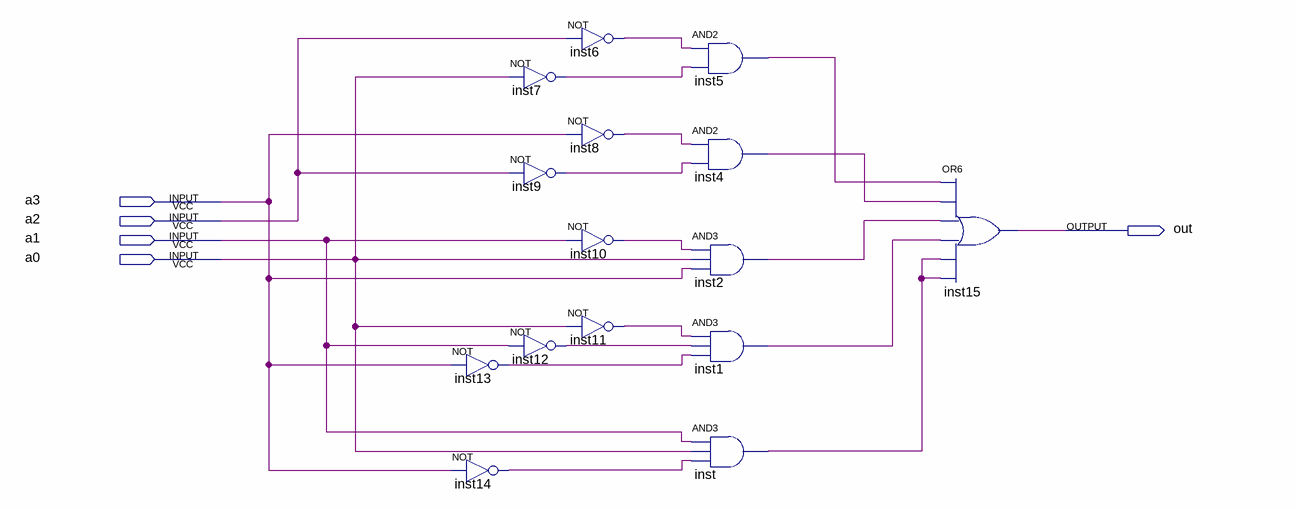
[diagram p0: schematic sheet]
// Quartus schematic FuncB.bdf as structural Verilog: 15 symbols, 5 pins
module FuncB (
  input  a3,
  input  a2,
  input  a1,
  input  a0,
  output out
);

  wire inst1_out, inst2_out, inst4_out, inst5_out, inst6_out, inst7_out, inst8_out, inst9_out, inst10_out,
       inst11_out, inst12_out, inst13_out, inst14_out, inst_out;

  not inst13 (inst13_out, a3);
  not inst14 (inst14_out, a3);
  not inst7 (inst7_out, a0);
  not inst9 (inst9_out, a2);
  not inst12 (inst12_out, a1);
  not inst6 (inst6_out, a2);
  not inst8 (inst8_out, a3);
  not inst10 (inst10_out, a1);
  not inst11 (inst11_out, a0);
  and inst5 (inst5_out, inst6_out, inst7_out);
  and inst4 (inst4_out, inst8_out, inst9_out);
  and inst2 (inst2_out, inst10_out, a0, a3);
  and inst1 (inst1_out, inst11_out, inst12_out, inst13_out);
  and inst (inst_out, a1, a0, inst14_out);
  or inst15 (out, inst5_out, inst4_out, inst2_out, inst1_out, inst_out, inst_out);
endmodule
